# Altium project 51 MCU Development board.PrjPCB
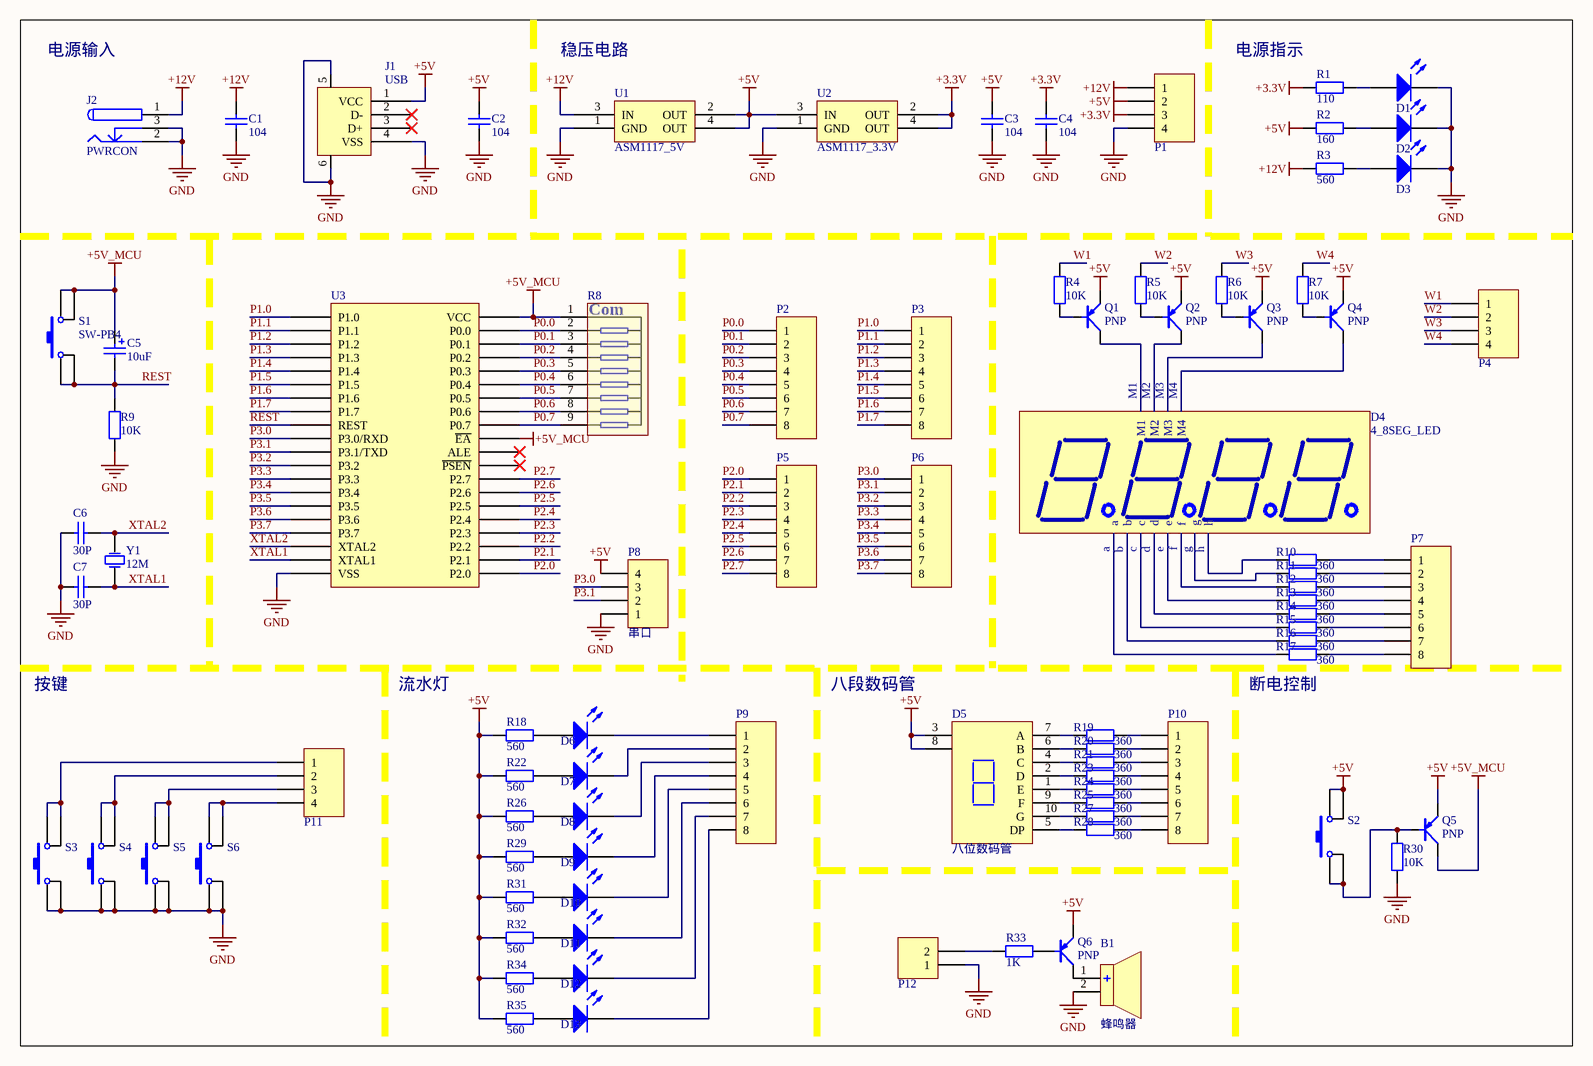
[diagram p0: 51 MCU Development board.SchDoc]
1 sheet, 86 parts. Net scope: global (net labels, ports and power ports of the same name join across sheets).
Board file: 51 MCU Development board.PcbDoc

## Sheet 51 MCU Development board.SchDoc
size A4

### Parts
B1  蜂鸣器  [蜂鸣器]
C1  value 104  [C-RAD-0805]  (hidden comment: Cap)
C2  value 104  [C-RAD-0805]  (hidden comment: Cap)
C3  value 104  [C-RAD-0805]  (hidden comment: Cap)
C4  value 104  [C-RAD-0805]  (hidden comment: Cap)
C5  value 10uF  [10UF]  (hidden comment: Cap Pol1)
C6  value 30P  [C-RAD]  (hidden comment: Cap)
C7  value 30P  [C-RAD]  (hidden comment: Cap)
D1  LED0  [LED_0805]  (value not drawn)
D2  LED0  [LED_0805]  (value not drawn)
D3  LED0  [LED_0805]  (value not drawn)
D4  4_8SEG_LED  [4BIT_8SEG_LED]
D5  八位数码管  [八位数码管]
D6  LED0  [LED直插]  (value not drawn)
D7  LED0  [LED直插]  (value not drawn)
D8  LED0  [LED直插]  (value not drawn)
D9  LED0  [LED直插]  (value not drawn)
D10  LED0  [LED直插]  (value not drawn)
D11  LED0  [LED直插]  (value not drawn)
D12  LED0  [LED直插]  (value not drawn)
D13  LED0  [LED直插]  (value not drawn)
J1  USB  [USB_A1]
J2  PWRCON  [DC-005]
P1  Header 4  [HDR4X1_A]  (value not drawn)
P2  Header 8  [HDR1X8]  (value not drawn)
P3  Header 8  [HDR1X8]  (value not drawn)
P4  Header 4  [HDR4X1_A]  (value not drawn)
P5  Header 8  [HDR1X8]  (value not drawn)
P6  Header 8  [HDR1X8]  (value not drawn)
P7  Header 8  [HDR1X8]  (value not drawn)
P8  串口  [HDR4X1_A]
P9  Header 8  [HDR1X8]  (value not drawn)
P10  Header 8  [HDR1X8]  (value not drawn)
P11  Header 4  [HDR4X1_A]  (value not drawn)
P12  Header 2  [HDR2X1_A]  (value not drawn)
Q1  PNP  [TO-92]
Q2  PNP  [TO-92]
Q3  PNP  [TO-92]
Q4  PNP  [TO-92]
Q5  PNP  [TO-92]
Q6  PNP  [TO-92]
R1  value 110  [0805-1]  (hidden comment: Res1)
R2  value 160  [0805-1]  (hidden comment: Res1)
R3  value 560  [0805-1]  (hidden comment: Res1)
R4  value 10K  [0805-1]  (hidden comment: Res1)
R5  value 10K  [0805-1]  (hidden comment: Res1)
R6  value 10K  [0805-1]  (hidden comment: Res1)
R7  value 10K  [0805-1]  (hidden comment: Res1)
R8  RES10  [SIP9]  (value not drawn)
R9  value 10K  [0805-1]  (hidden comment: Res1)
R10  value 360  [0805-1]  (hidden comment: Res1)
R11  value 360  [0805-1]  (hidden comment: Res1)
R12  value 360  [0805-1]  (hidden comment: Res1)
R13  value 360  [0805-1]  (hidden comment: Res1)
R14  value 360  [0805-1]  (hidden comment: Res1)
R15  value 360  [0805-1]  (hidden comment: Res1)
R16  value 360  [0805-1]  (hidden comment: Res1)
R17  value 360  [0805-1]  (hidden comment: Res1)
R18  value 560  [0805-1]  (hidden comment: Res1)
R19  value 360  [0805-1]  (hidden comment: Res1)
R20  value 360  [0805-1]  (hidden comment: Res1)
R21  value 360  [0805-1]  (hidden comment: Res1)
R22  value 560  [0805-1]  (hidden comment: Res1)
R23  value 360  [0805-1]  (hidden comment: Res1)
R24  value 360  [0805-1]  (hidden comment: Res1)
R25  value 360  [0805-1]  (hidden comment: Res1)
R26  value 560  [0805-1]  (hidden comment: Res1)
R27  value 360  [0805-1]  (hidden comment: Res1)
R28  value 360  [0805-1]  (hidden comment: Res1)
R29  value 560  [0805-1]  (hidden comment: Res1)
R30  value 10K  [0805-1]  (hidden comment: Res1)
R31  value 560  [0805-1]  (hidden comment: Res1)
R32  value 560  [0805-1]  (hidden comment: Res1)
R33  value 1K  [0805-1]  (hidden comment: Res1)
R34  value 560  [0805-1]  (hidden comment: Res1)
R35  value 560  [0805-1]  (hidden comment: Res1)
S1  SW-PB4  [AN66]
S2  SW-PB4  [AN66]  (value not drawn)
S3  SW-PB4  [AN66]  (value not drawn)
S4  SW-PB4  [AN66]  (value not drawn)
S5  SW-PB4  [AN66]  (value not drawn)
S6  SW-PB4  [AN66]  (value not drawn)
U1  ASM1117_5V  [SOT-223]
U2  ASM1117_3.3V  [SOT-223]
U3  STC89C52RC  [DIP-40W]  (value not drawn)
Y1  value 12M  [X-HC49U]  (hidden comment: XTAL)

### Nets
+3.3V: C4.2 P1.3 R1.1 U2.2(OUT) U2.4(OUT)
+5V: C2.2 C3.2 D5.3 D5.8 J1.1(VCC) P1.2 P8.4 Q1.E(e) Q2.E(e) Q3.E(e) Q4.E(e) Q5.E(e) Q6.E(e) R2.1 R18.1 R22.1 R26.1 R29.1 R31.1 R32.1 R34.1 R35.1 S2.2 S2.3 U1.2(OUT) U1.4(OUT) U2.3(IN)
+5V_MCU: C5.1 Q5.C(c) R8.1(Com) S1.2 S1.3 U3.31(~{E}~{A}) U3.40(VCC)
+12V: C1.2 J2.1 P1.1 R3.1 U1.3(IN)
GND: B1.2 C1.1 C2.1 C3.1 C4.1 C6.1 C7.1 D1.2(K) D2.2(K) D3.2(K) J1.4(VSS) J1.5 J1.6 J2.2 J2.3 P1.4 P8.1 P12.1 R9.1 R30.1 S3.1 S3.4 S4.1 S4.4 S5.1 S5.4 S6.1 S6.4 U1.1(GND) U2.1(GND) U3.20(VSS)
P0.0: P2.1 R8.2 U3.39(P0.0)
P0.1: P2.2 R8.3 U3.38(P0.1)
P0.2: P2.3 R8.4 U3.37(P0.2)
P0.3: P2.4 R8.5 U3.36(P0.3)
P0.4: P2.5 R8.6 U3.35(P0.4)
P0.5: P2.6 R8.7 U3.34(P0.5)
P0.6: P2.7 R8.8 U3.33(P0.6)
P0.7: P2.8 R8.9 U3.32(P0.7)
P1.0: P3.1 U3.1(P1.0)
P1.1: P3.2 U3.2(P1.1)
P1.2: P3.3 U3.3(P1.2)
P1.3: P3.4 U3.4(P1.3)
P1.4: P3.5 U3.5(P1.4)
P1.5: P3.6 U3.6(P1.5)
P1.6: P3.7 U3.7(P1.6)
P1.7: P3.8 U3.8(P1.7)
P2.0: P5.1 U3.21(P2.0)
P2.1: P5.2 U3.22(P2.1)
P2.2: P5.3 U3.23(P2.2)
P2.3: P5.4 U3.24(P2.3)
P2.4: P5.5 U3.25(P2.4)
P2.5: P5.6 U3.26(P2.5)
P2.6: P5.7 U3.27(P2.6)
P2.7: P5.8 U3.28(P2.7)
P3.0: P6.1 P8.3 U3.10(P3.0/RXD)
P3.1: P6.2 P8.2 U3.11(P3.1/TXD)
P3.2: P6.3 U3.12(P3.2)
P3.3: P6.4 U3.13(P3.3)
P3.4: P6.5 U3.14(P3.4)
P3.5: P6.6 U3.15(P3.5)
P3.6: P6.7 U3.16(P3.6)
P3.7: P6.8 U3.17(P3.7)
REST: C5.2 R9.2 S1.1 S1.4 U3.9(REST)
W1: P4.1 R4.2
W2: P4.2 R5.2
W3: P4.3 R6.2
W4: P4.4 R7.2
XTAL1: C7.2 U3.19(XTAL1) Y1.1(OSC1)
XTAL2: C6.2 U3.18(XTAL2) Y1.2(OSC2)
NetB1_1: B1.1 Q6.C(c)
NetD1_1: D1.1(A) R1.2
NetD2_1: D2.1(A) R2.2
NetD3_1: D3.1(A) R3.2
NetD4_a: D4.a R17.2
NetD4_b: D4.b R16.2
NetD4_c: D4.c R15.2
NetD4_d: D4.d R14.2
NetD4_e: D4.e R13.2
NetD4_f: D4.f R12.2
NetD4_g: D4.g R11.2
NetD4_h: D4.h R10.2
NetD4_M1: D4.M1 Q1.C(c)
NetD4_M2: D4.M2 Q2.C(c)
NetD4_M3: D4.M3 Q3.C(c)
NetD4_M4: D4.M4 Q4.C(c)
NetD5_1: D5.1(E) R24.2
NetD5_2: D5.2(D) R23.2
NetD5_4: D5.4(C) R21.2
NetD5_5: D5.5(DP) R28.2
NetD5_6: D5.6(B) R20.2
NetD5_7: D5.7(A) R19.2
NetD5_9: D5.9(F) R25.2
NetD5_10: D5.10(G) R27.2
NetD6_1: D6.1(A) R18.2
NetD6_2: D6.2(K) P9.1
NetD7_1: D7.1(A) R22.2
NetD7_2: D7.2(K) P9.2
NetD8_1: D8.1(A) R26.2
NetD8_2: D8.2(K) P9.3
NetD9_1: D9.1(A) R29.2
NetD9_2: D9.2(K) P9.4
NetD10_1: D10.1(A) R31.2
NetD10_2: D10.2(K) P9.5
NetD11_1: D11.1(A) R32.2
NetD11_2: D11.2(K) P9.6
NetD12_1: D12.1(A) R34.2
NetD12_2: D12.2(K) P9.7
NetD13_1: D13.1(A) R35.2
NetD13_2: D13.2(K) P9.8
NetP7_1: P7.1 R10.1
NetP7_2: P7.2 R11.1
NetP7_3: P7.3 R12.1
NetP7_4: P7.4 R13.1
NetP7_5: P7.5 R14.1
NetP7_6: P7.6 R15.1
NetP7_7: P7.7 R16.1
NetP7_8: P7.8 R17.1
NetP10_1: P10.1 R19.1
NetP10_2: P10.2 R20.1
NetP10_3: P10.3 R21.1
NetP10_4: P10.4 R23.1
NetP10_5: P10.5 R24.1
NetP10_6: P10.6 R25.1
NetP10_7: P10.7 R27.1
NetP10_8: P10.8 R28.1
NetP11_1: P11.1 S3.2 S3.3
NetP11_2: P11.2 S4.2 S4.3
NetP11_3: P11.3 S5.2 S5.3
NetP11_4: P11.4 S6.2 S6.3
NetP12_2: P12.2 R33.2
NetQ1_B: Q1.B(b) R4.1
NetQ2_B: Q2.B(b) R5.1
NetQ3_B: Q3.B(b) R6.1
NetQ4_B: Q4.B(b) R7.1
NetQ5_B: Q5.B(b) R30.2 S2.1 S2.4
NetQ6_B: Q6.B(b) R33.1

Not connected (* = marked no-connect by the designer): J1 2(D-)* 3(D+)*; U3 29(~{P}~{S}~{E}~{N})* 30(ALE)*

### Notes on the sheet
- 电源输入
- 稳压电路
- 电源指示
- 按键
- 流水灯
- 八段数码管
- 断电控制

### Library data of the parts
C1-C4 C6 C7 = Cap: 无极性电容; Published: 8-Jun-2000; LatestRevisionDate: 17-Jul-2002; LatestRevisionNote: Re-released for DXP Platform.; PackageReference: RAD-0.3; Publisher: Altium Limited
C5 = Cap Pol1: Polarized Capacitor (Radial); Published: 8-Jun-2000; LatestRevisionDate: 17-Jul-2002; LatestRevisionNote: Re-released for DXP Platform.; PackageReference: RB7.6-15; Publisher: Altium Limited; PackageDescription: Polarized Capacitor (Radial); 2 Leads
D1-D3 D6-D13 = LED0: 发光二极管; Published: 8-Jun-2000; LatestRevisionDate: 08-Jul-2005; LatestRevisionNote: Mech Layer 1 removed.; PackageReference: LED-0; Publisher: Altium Limited
J1 = USB: USB接口
J2 = PWRCON: 直流电源端子; Published: 17-Dec-2003; DatasheetDocument: 09-May-2002; Publisher: Altium Limited; ComponentLink1Description: Manufacturer Link; ComponentLink1URL: http://domino.kycon.com/internet/Products.html
P1 P4 P8 P11 = Header 4: 接插件; LatestRevisionDate: 17-Jul-2002; LatestRevisionNote: Re-released for DXP Platform.; Publisher: Altium Limited
P2 P3 P5-P7 P9 P10 = Header 8: Header, 8-Pin; LatestRevisionDate: 17-Jul-2002; LatestRevisionNote: Re-released for DXP Platform.; Publisher: Altium Limited
P12 = Header 2: 接插件; LatestRevisionDate: 17-Jul-2002; LatestRevisionNote: Re-released for DXP Platform.; Publisher: Altium Limited
R1-R7 R9-R35 = Res1: 贴片电阻; Published: 8-Jun-2000; LatestRevisionDate: 17-Jul-2002; LatestRevisionNote: Re-released for DXP Platform.; PackageReference: AXIAL-0.4; Publisher: Altium Limited
S1-S6 = SW-PB4: 微动开关; Published: 24-Mar-1999; LatestRevisionDate: 17-Jul-2002; LatestRevisionNote: Re-released for DXP Platform.; PackageReference: SPST-2; Publisher: Altium Limited
U1 U2 = ASM1117: 3.3V稳压芯片
Y1 = XTAL: 晶振; Published: 8-Jun-2000; LatestRevisionDate: 17-Jul-2002; LatestRevisionNote: Re-released for DXP Platform.; PackageReference: R38; Publisher: Altium Limited